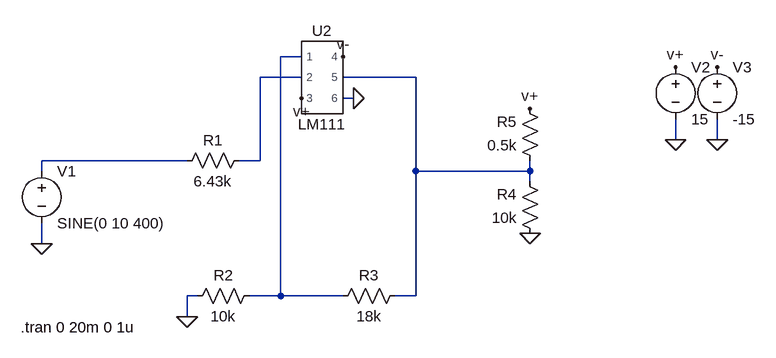
[diagram p0: schematic Onda Cuadrada Ejemplo 16-1.asc]
Onda Cuadrada Ejemplo 16-1.asc, the LTspice schematic file:
Version 4
SHEET 1 1140 680
WIRE -720 -64 -752 -64
WIRE -720 -32 -784 -32
WIRE -544 -32 -656 -32
WIRE -640 0 -656 0
WIRE -144 64 -144 32
WIRE -80 64 -80 32
WIRE -896 96 -1120 96
WIRE -784 96 -784 -32
WIRE -784 96 -816 96
WIRE -1120 112 -1120 96
WIRE -544 112 -544 -32
WIRE -368 112 -368 96
WIRE -368 112 -544 112
WIRE -368 128 -368 112
WIRE -1120 224 -1120 192
WIRE -880 304 -896 304
WIRE -752 304 -752 -64
WIRE -752 304 -800 304
WIRE -656 304 -752 304
WIRE -544 304 -544 112
WIRE -544 304 -576 304
WIRE -896 336 -896 304
FLAG -1120 224 0
FLAG -368 208 0
FLAG -640 0 0
FLAG -896 336 0
FLAG -720 0 v+
FLAG -144 -48 v+
FLAG -656 -64 v-
FLAG -80 -48 v-
FLAG -368 16 v+
FLAG -144 64 0
FLAG -80 64 0
SYMBOL voltage -1120 96 R0
WINDOW 123 0 0 Left 2
WINDOW 39 0 0 Left 2
SYMATTR InstName V1
SYMATTR Value SINE(0 10 400)
SYMBOL res -800 80 R90
WINDOW 0 0 56 VBottom 2
WINDOW 3 32 56 VTop 2
SYMATTR InstName R1
SYMATTR Value 6.43k
SYMBOL res -784 288 R90
WINDOW 0 0 56 VBottom 2
WINDOW 3 32 56 VTop 2
SYMATTR InstName R2
SYMATTR Value 10k
SYMBOL res -560 288 R90
WINDOW 0 0 56 VBottom 2
WINDOW 3 32 56 VTop 2
SYMATTR InstName R3
SYMATTR Value 18k
SYMBOL res -352 224 R180
WINDOW 0 36 76 Left 2
WINDOW 3 36 40 Left 2
SYMATTR InstName R4
SYMATTR Value 10k
SYMBOL res -352 112 R180
WINDOW 0 36 76 Left 2
WINDOW 3 36 40 Left 2
SYMATTR InstName R5
SYMATTR Value 0.5k
SYMBOL voltage -144 -64 R0
WINDOW 123 0 0 Left 2
WINDOW 39 0 0 Left 2
SYMATTR InstName V2
SYMATTR Value 15
SYMBOL voltage -80 -64 R0
WINDOW 123 0 0 Left 2
WINDOW 39 0 0 Left 2
SYMATTR InstName V3
SYMATTR Value -15
SYMBOL AutoGenerated/LM111 -688 -32 R0
SYMATTR InstName U2
TEXT -1152 352 Left 2 !.tran 0 20m 0 1u

The netlist it stands for:
* Onda Cuadrada Ejemplo 16-1.asc
V1 N004 0 SINE(0 10 400)
R1 N002 N004 6.43k
R2 N001 0 10k
R3 N003 N001 18k
R4 0 N003 10k
R5 N003 v+ 0.5k
V2 v+ 0 15
V3 v- 0 -15
XU2 N001 N002 v+ v- N003 0 LM111  ; pins 1 2 3 4 5 6
.tran 0 20m 0 1u
.lib /Users/Caro/Downloads/LM111.301
.backanno
.end